# EAGLE design AJH_HeadphoneAmp_01 (EAGLE 9.5.2)
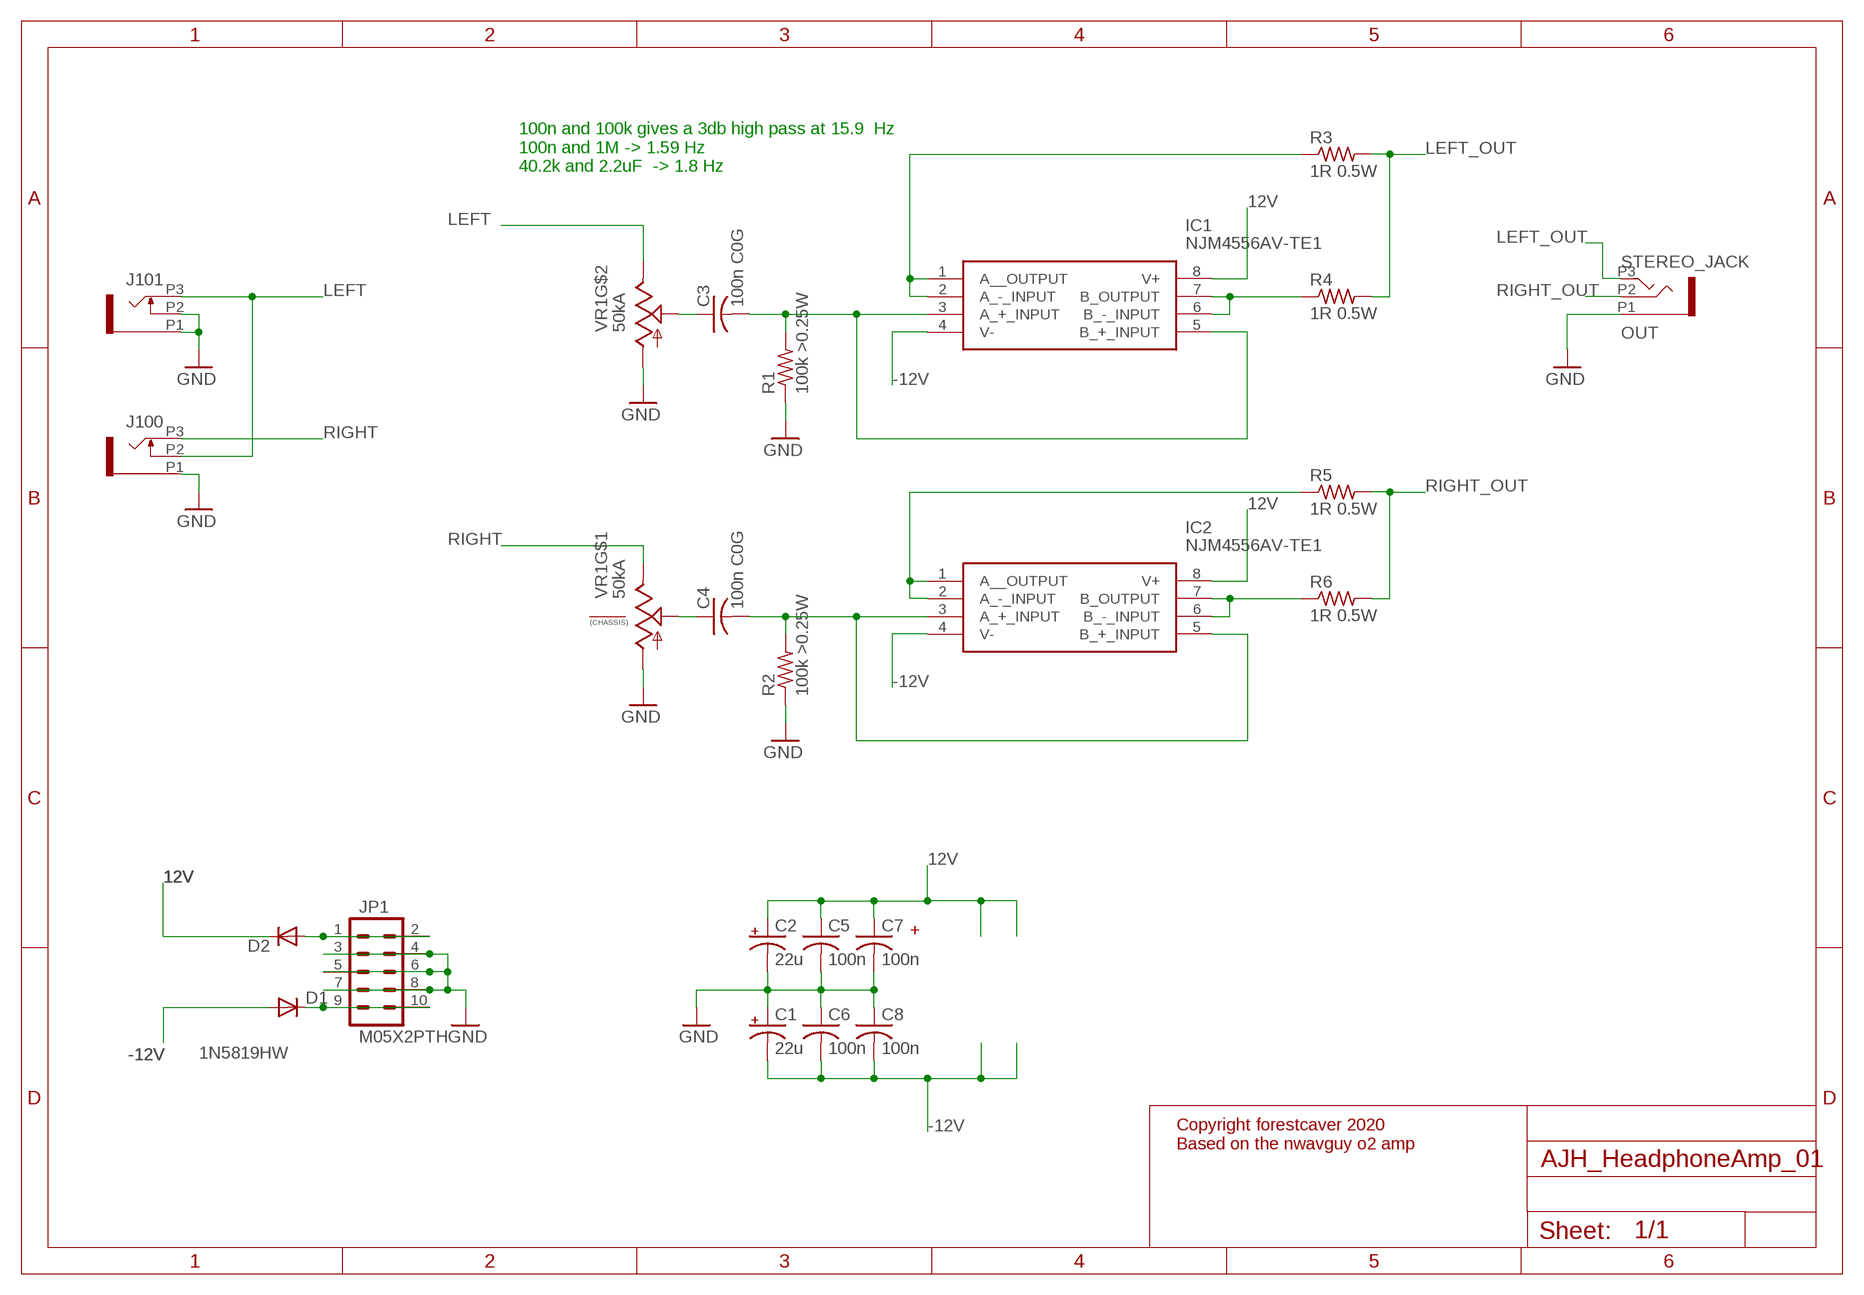
[diagram p0: schematic, sheet 1]

## Parts
C1  22u  CPOL-USB  [PANASONIC_B]
C2  22u  CPOL-USB  [PANASONIC_B]
C3  100n C0G  C-USC1206  [C1206]
C4  100n C0G  C-USC1206  [C1206]
C5  100n  C-USC0603  [C0603]
C6  100n  C-USC0603  [C0603]
C7  100n  C-USC0603  [C0603]
C8  100n  C-USC0603  [C0603]
D1  1N5819HW  DIODE-SOD123  [SOD123]
D2  1N5819HW  DIODE-SOD123  [SOD123]
IC1  NJM4556AV-TE1  [SOP65P640X145-8N]
IC2  NJM4556AV-TE1  [SOP65P640X145-8N]
J100  PJ301_THONKICONN6  [WQP_PJ_301M6]
J101  PJ301_THONKICONN6  [WQP_PJ_301M6]
JP1  M05X2PTH  [AVR_ICSP]
OUT  STEREO_JACK  PJ366ST  [WQP_PJ_301M8]
R1  100k >0.25W  R-US_R1206  [R1206]
R2  100k >0.25W  R-US_R1206  [R1206]
R3  1R 0.5W  R-US_R1206  [R1206]
R4  1R 0.5W  R-US_R1206  [R1206]
R5  1R 0.5W  R-US_R1206  [R1206]
R6  1R 0.5W  R-US_R1206  [R1206]
VR1  50kA  ALPHA-9MM-DUALPOT  [DUAL_9MM_SNAP-IN_POT]

## Nets
12V [power]: C2.+ C5.1 C7.1 D2.C IC1.8(V+) IC2.8(V+)
-12V [power]: C1.- C6.2 C8.2 D1.A IC1.4(V-) IC2.4(V-)
GND [power]: C1.+ C2.- C5.2 C6.1 C7.2 C8.1 J100.P1 J101.P1 J101.P2 JP1.3 JP1.4 JP1.5 JP1.6 JP1.7 JP1.8 OUT.P1 R1.1 R2.1 VR1.1(A) VR1.1B(A)
LEFT: J100.P2 J101.P3 VR1.3B(E)
LEFT_OUT: OUT.P3 R3.2 R4.2
N$1: C4.1 VR1.2(S)
N$2: C3.1 VR1.2B(S)
N$3: C4.2 IC2.3(A_+_INPUT) IC2.5(B_+_INPUT) R2.2
N$4: C3.2 IC1.3(A_+_INPUT) IC1.5(B_+_INPUT) R1.2
N$5: IC1.6(B_-_INPUT) IC1.7(B_OUTPUT) R4.1
N$6: D2.A JP1.1 JP1.2
N$7: IC2.1(A__OUTPUT) IC2.2(A_-_INPUT) R5.1
N$8: IC2.6(B_-_INPUT) IC2.7(B_OUTPUT) R6.1
N$9: IC1.1(A__OUTPUT) IC1.2(A_-_INPUT) R3.1
N$20: D1.C JP1.9 JP1.10
RIGHT: J100.P3 VR1.3(E)
RIGHT_OUT: OUT.P2 R5.2 R6.2
Unconnected: VR1.CHASSIS1 VR1.CHASSIS2

## Notes on the sheet
- 100n and 100k gives a 3db high pass at 15.9  Hz
  100n and 1M -> 1.59 Hz
  40.2k and 2.2uF  -> 1.8 Hz
- +
- Copyright forestcaver 2020
  Based on the nwavguy o2 amp

## Library data of the parts
C1 C2 = rcl:CPOL-US: POLARIZED CAPACITOR, American symbol
C3 C4 = rcl:C-US: CAPACITOR, American symbol; SPICEPREFIX: C
C5-C8 = rcl:C-US: CAPACITOR, American symbol
D1 D2 = diode:DIODE-: DIODE
IC1 IC2 = NJM4556AV-TE1:NJM4556AV-TE1: OP Amp Dual GP 18V 8-Pin SSOP New Japan Radio NJM4556AV-TE1, Dual Op Amp, 8MHz, 8-Pin SSOP Source: Datasheet <http://uk.rs-online.com/web/p/products/7139458>; ALLIED_NUMBER: R1030686; ALLIED_PRICE-STOCK: https://www.alliedelec.com/new-japan-radio-njm4556av-te1/R1030686/; DESCRIPTION: OP Amp Dual GP 18V 8-Pin SSOP New Japan Radio NJM4556AV-TE1, Dual Op Amp, 8MHz, 8-Pin SSOP; HEIGHT: 1.45mm; MANUFACTURER_NAME: New Japan Radio; MANUFACTURER_PART_NUMBER: NJM4556AV-TE1; RS_PART_NUMBER: 7139458P; RS_PRICE-STOCK: http://uk.rs-online.com/web/p/products/7139458P
J100 J101 = og-pj301_variations:PJ301_THONKICONN
JP1 = og-header:M05X2: Header 5x2 Standard 10-pin dual row 0.1" header. Commonly used with AVR-ISP. Use with Spark Fun Electronics SKU: PRT-00778
OUT = AJHParts:PJ366ST
R1-R6 = rcl:R-US_: RESISTOR, American symbol; SPICEPREFIX: R
VR1 = MusicThingModular:ALPHA-9MM-DUALPOT: 9mm vertical snap-in pot, Alpha / Panasonic style, with a connection to the metal chassis for grounding

## Net classes
0 default: width 0.152 mm
1 power: width 0.406 mm
2 nearfilter: width 0.152 mm

## Board
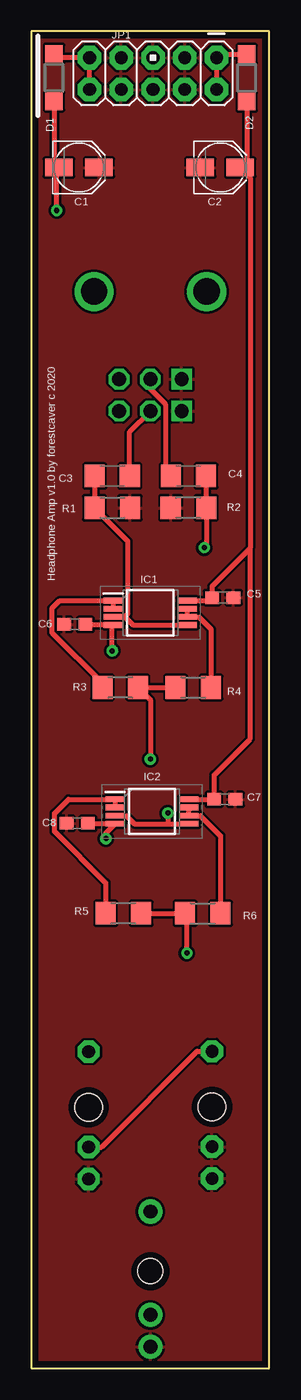
[diagram p1: board, top side]
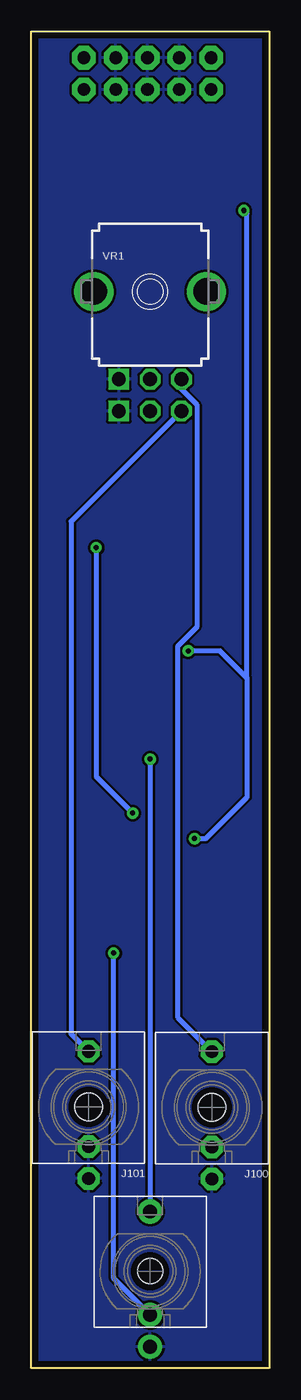
[diagram p2: board, bottom side, seen from below]

Size 19.03 x 106.76 mm. Coordinates in mm from the lower left corner, seen from the top.
Outline: 0,0 19.03,0 19.03,106.76 0,106.76 0,0
Copper layers (1*16): Top 0.035mm / dielectric 1.5mm / Bottom 0.035mm
Design rules "Mutable_PCBCart-Standard": minimum track width 8mil, minimum drill 0.4mm, track to track 8mil, track to pad 8mil, pad to pad 8mil, via to via 8mil, smd to smd 8mil, copper to edge 20mil, drill to drill 8mil, minimum pad ring 8mil, minimum via ring 10mil, stop-mask expansion 3mil, vias tented up to drill 25mil, thermal gap 8mil

### Footprints (pad centres in the part's own frame; a part is rotated, then mirrored left to right if it is on the bottom)
PANASONIC_B = smd 2.2 x 1.4: + 1.6,0; - -1.6,0
C1206 = smd 1.6 x 1.8: 1 -1.4,0; 2 1.4,0
C0603 = smd 1.1 x 1: 1 -0.85,0; 2 0.85,0
SOD123 = smd 1.4 x 1.4: A 1.9,0; C -1.9,0
SOP65P640X145-8N = smd 1.525 x 0.45: 1 -2.962,0.975; 2 -2.962,0.325; 3 -2.962,-0.325; 4 -2.962,-0.975; 5 2.962,-0.975; 6 2.962,-0.325; 7 2.962,0.325; 8 2.962,0.975
WQP_PJ_301M6 = drill 1.016 pad 1.778 octagon: P1 0,-5.715; P2 0,-3.175; P3 0,4.445 | hole 2.2: 0,0
AVR_ICSP = drill 1.016 pad 1.88 octagon: 1 -1.27,5.08; 2 1.27,5.08; 3 -1.27,2.54; 4 1.27,2.54; 5 -1.27,0; 6 1.27,0; 7 -1.27,-2.54; 8 1.27,-2.54; 9 -1.27,-5.08; 10 1.27,-5.08
WQP_PJ_301M8 = drill 1.1 pad 1.93: P1 0,-6.032; P2 0,-3.493; P3 0,4.763 | hole 2: 0,0
R1206 = smd 1.6 x 1.803: 1 -1.422,0; 2 1.422,0
DUAL_9MM_SNAP-IN_POT = drill 1.1 square: 1 -2.5,-7; 1B -2.5,-9.54 | drill 1.1 octagon: 2 0,-7; 2B 0,-9.54; 3 2.5,-7; 3B 2.5,-9.54 | drill 2.1 pad 2.54: CHASSIS1 -4.5,0; CHASSIS2 4.5,0

### Placement (x,y rotation side)
C1  3.81,95.89 0 top
C2  15.11,95.89 0 top
C3  6.48,71.25 180 top
C4  12.57,71.25 0 top
C5  15.32,61.53 0 top
C6  3.48,59.39 0 top
C7  15.48,45.42 0 top
C8  3.67,43.52 0 top
D1  1.83,103.06 270 top
D2  17.23,103.04 90 top
IC1  9.53,60.33 0 top
IC2  9.65,44.45 0 top
J100  4.59,20.83 0 bottom
J101  14.45,20.86 0 bottom
JP1  9.74,103.38 270 top
OUT  9.53,7.75 0 bottom
R1  6.48,68.71 180 top
R2  12.57,68.71 0 top
R3  7.11,54.36 0 top
R4  12.95,54.36 180 top
R5  7.37,36.32 0 top
R6  13.72,36.32 180 top
VR1  9.53,85.98 0 bottom

### Tracks (layer width: path | path; a pad name or v marks a point on that pad's centre or on a via)
12V
  Top 0.406: 17.1,101.14 D2.C 17.23,96.4 C2.+ 17.51,95.08 17.51,65.5 | IC1.8 14.23,61.3 C5.1 14.47,62.46 17.51,65.5 | IC2.8 C7.1 14.63,47.38 17.51,50.26 17.51,65.5
-12V  (via drill 0.4)
  Top 0.406: D1.A 1.83,96.27 2.12,95.97 | 2.12,95.97 C1.- | C6.2 5.61,59.39 5.63,59.37 6.54,59.37 | 6.54,59.37 IC1.4 | C8.2 4.56,43.48 IC2.4 5.97,42.75 v5.97,42.29 | v6.48,57.28 6.48,59.3 6.54,59.37 | v2.03,92.46 2.03,95.89 2.12,95.97
  Bottom 0.406: 1.78,55.12 1.78,45.59 5.08,42.29 v5.97,42.29 | 1.78,55.12 3.94,57.28 v6.48,57.28 | 1.78,55.12 1.78,92.2 v2.03,92.46
GND
  pour Top: -0.89,107.7 19.43,107.7 20.07,107.06 20.32,106.81 20.32,-0.25 19.3,-1.27 -0.25,-1.27 -0.89,-0.64
  pour Bottom: -1.4,108.33 20.07,108.33 20.07,-0.64 -1.14,-0.64 -1.4,-0.38
LEFT
  Top 0.406: J100.P2 5.6,17.65 13.26,25.31 J101.P3
  Bottom 0.406: VR1.3B 15.85,67.62 15.85,26.7 J101.P3
LEFT_OUT  (via drill 0.4)
  Top 0.406: R4.2 R3.2 9.53,53.37 v9.53,48.64
  Bottom 0.406: v9.53,48.64 OUT.P3
N$1
  Top 0.203: C4.1 10.89,71.53
  Top 0.406: VR1.2 9.53,78.18 10.76,76.95 10.76,71.66 C4.1
N$2
  Top 0.406: C3.1 7.88,74.79 VR1.2B
N$3  (via drill 0.4)
  Top 0.203: 13.97,68.73 13.98,68.72 R2.2
  Top 0.406: IC2.3 6.71,44.11 7.62,44.11 8.25,43.48 10.92,43.48 | 10.92,43.48 IC2.5 | C4.2 13.98,71.24 13.98,68.72 | R2.2 13.99,65.68 v13.84,65.53 | v10.92,44.32 10.92,43.48
  Bottom 0.406: v13.84,65.53 13.84,47.24 v10.92,44.32
N$4
  Top 0.203: 5.08,68.73 R1.2
  Top 0.406: IC1.3 6.58,59.98 7.49,59.98 | IC1.5 8.12,59.35 7.49,59.98 | 7.49,59.98 7.49,60.02 7.73,60.26 7.73,66.03 R1.2 | C3.2 5.08,68.73
N$5
  Top 0.406: IC1.7 IC1.6 12.51,59.98 13.42,59.98 14.38,59.02 R4.1
N$6
  Top 0.406: JP1.2 JP1.1 15.11,104.94 D2.A
N$7
  Top 0.406: IC2.2 IC2.1 2.97,45.42 1.86,44.31 1.86,42.85 5.94,38.77 R5.1
N$8
  Top 0.406: IC2.7 IC2.6 12.63,44.11 13.54,44.11 15.14,42.51 R6.1
N$9
  Top 0.406: 6.54,60.63 IC1.2 IC1.1 2.27,61.3 1.67,60.7 1.67,58.73 5.69,54.71 R3.1
N$20
  Top 0.406: D1.C 2.14,104.65 JP1.9 JP1.10
RIGHT
  Bottom 0.406: VR1.3 7.03,78.18 5.79,76.95 5.79,59.18 7.34,57.63 7.34,28.02 J100.P3
RIGHT_OUT  (via drill 0.4)
  Top 0.406: R5.2 12.06,36.32 | 12.06,36.32 R6.2 | v12.45,33.15 12.45,35.94 12.06,36.32
  Bottom 0.406: OUT.P2 12.45,7.18 v12.45,33.15

### Text on the board
tPlace: Headphone Amp v1.0 by forestcaver c 2020